# EAGLE design StormNet18-v0.1 (EAGLE 7.7.0)
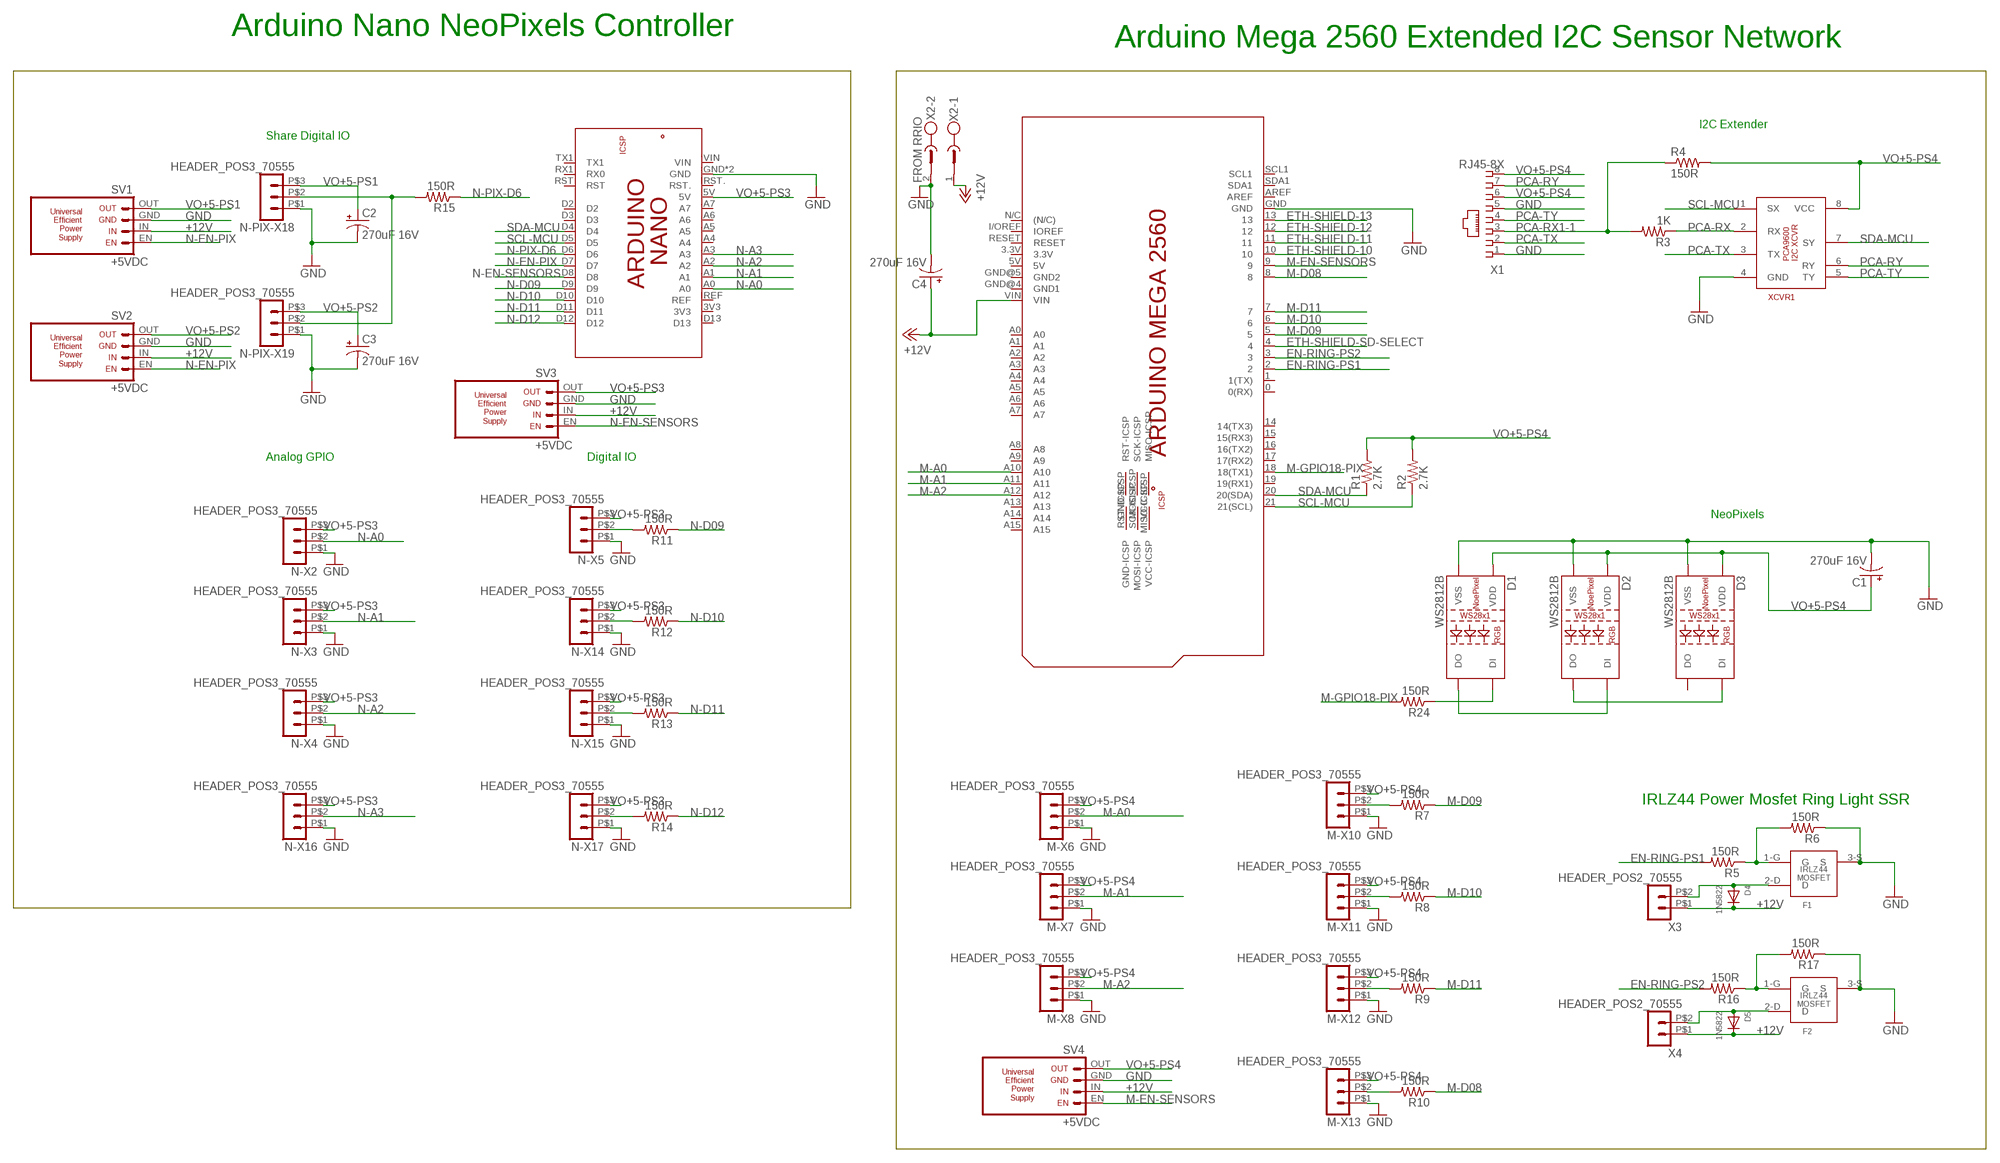
[diagram p0: schematic, sheet 1]

## Parts
C1  270uF 16V  CPOL-USE3.5-8  [E3,5-8]
C2  270uF 16V  CPOL-USE3.5-8  [E3,5-8]
C3  270uF 16V  CPOL-USE3.5-8  [E3,5-8]
C4  270uF 16V  CPOL-USE3.5-8  [E3,5-8]
D1  WS2812B  [WS2812B]
D2  WS2812B  [WS2812B]
D3  WS2812B  [WS2812B]
D4  1N5822  DIODESMA  [SMADIODE]
D5  1N5822  DIODESMA  [SMADIODE]
F1  IRLZ44  [IRLZ44-TO220]
F2  IRLZ44  [IRLZ44-TO220]
M-X6  HEADER_POS3_70555  [70555-POS3]
M-X7  HEADER_POS3_70555  [70555-POS3]
M-X8  HEADER_POS3_70555  [70555-POS3]
M-X10  HEADER_POS3_70555  [70555-POS3]
M-X11  HEADER_POS3_70555  [70555-POS3]
M-X12  HEADER_POS3_70555  [70555-POS3]
M-X13  HEADER_POS3_70555  [70555-POS3]
N-PIX-X18  HEADER_POS3_70555  [70555-POS3]
N-PIX-X19  HEADER_POS3_70555  [70555-POS3]
N-X2  HEADER_POS3_70555  [70555-POS3]
N-X3  HEADER_POS3_70555  [70555-POS3]
N-X4  HEADER_POS3_70555  [70555-POS3]
N-X5  HEADER_POS3_70555  [70555-POS3]
N-X14  HEADER_POS3_70555  [70555-POS3]
N-X15  HEADER_POS3_70555  [70555-POS3]
N-X16  HEADER_POS3_70555  [70555-POS3]
N-X17  HEADER_POS3_70555  [70555-POS3]
PCB2  ARDUINO_MEGA2560_SMALL  [ARDUINO_MEGA2560_SMALL]
PCB3  ARDUINO_NANOWITHOUT_ICSP  [ARDUINO_NANO]
R1  2.7K  R-US_R0603  [R0603]
R2  2.7K  R-US_R0603  [R0603]
R3  1K  R-US_R0603  [R0603]
R4  150R  R-US_R0603  [R0603]
R5  150R  R-US_R0603  [R0603]
R6  150R  R-US_R0603  [R0603]
R7  150R  R-US_R0603  [R0603]
R8  150R  R-US_R0603  [R0603]
R9  150R  R-US_R0603  [R0603]
R10  150R  R-US_R0603  [R0603]
R11  150R  R-US_R0603  [R0603]
R12  150R  R-US_R0603  [R0603]
R13  150R  R-US_R0603  [R0603]
R14  150R  R-US_R0603  [R0603]
R15  150R  R-US_R0603  [R0603]
R16  150R  R-US_R0603  [R0603]
R17  150R  R-US_R0603  [R0603]
R24  150R  R-US_R0603  [R0603]
SV1  +5VDC  SUPPLY-UNIV-EFFICIENT  [PS-UNIV-EFFICIENT-3A]
SV2  +5VDC  SUPPLY-UNIV-EFFICIENT  [PS-UNIV-EFFICIENT-3A]
SV3  +5VDC  SUPPLY-UNIV-EFFICIENT  [PS-UNIV-EFFICIENT-3A]
SV4  +5VDC  SUPPLY-UNIV-EFFICIENT  [PS-UNIV-EFFICIENT-3A]
X1  RJ45-8X  [RJ45-NO-SHIELD]
X2  FROM RRIO  MSTBV2  [MSTBV2-SMALL]
X3  HEADER_POS2_70555  [70555-POS2]
X4  HEADER_POS2_70555  [70555-POS2]
XCVR1  PCA9600DSO8  [SO08]

## Nets
+12V [12VandGND]: C4.+ D4.C D5.C PCB2.VIN SV1.IN SV2.IN SV3.IN SV4.IN X2.1 X3.P$1 X4.P$1
EN-RING-PS1: PCB2.2 R5.2
EN-RING-PS2: PCB2.3 R16.2
ETH-SHIELD-10: PCB2.10
ETH-SHIELD-11: PCB2.11
ETH-SHIELD-12: PCB2.12
ETH-SHIELD-13: PCB2.13
ETH-SHIELD-SD-SELECT: PCB2.4
GND [12VandGND]: C1.- C2.- C3.- C4.- D1.3(VSS) D2.3(VSS) D3.3(VSS) F1.3-S(S) F2.3-S(S) M-X6.P$1 M-X7.P$1 M-X8.P$1 M-X10.P$1 M-X11.P$1 M-X12.P$1 M-X13.P$1 N-PIX-X18.P$1 N-PIX-X19.P$1 N-X2.P$1 N-X3.P$1 N-X4.P$1 N-X5.P$1 N-X14.P$1 N-X15.P$1 N-X16.P$1 N-X17.P$1 PCB2.GND PCB3.GND PCB3.GND@1(GND) R6.1 R17.1 SV1.GND SV2.GND SV3.GND SV4.GND X1.1 X1.5 X2.2 XCVR1.4(GND)
M-A0: M-X6.P$2 PCB2.A10
M-A1: M-X7.P$2 PCB2.A11
M-A2: M-X8.P$2 PCB2.A12
M-D08: PCB2.8 R10.1
M-D09: PCB2.5 R7.1
M-D10: PCB2.6 R8.1
M-D11: PCB2.7 R9.1
M-EN-SENSORS: PCB2.9 SV4.EN
M-GPIO18-PIX: PCB2.18(18(TX1)) R24.2
N$1: M-X10.P$2 R7.2
N$2: N-PIX-X18.P$2 N-PIX-X19.P$2 R15.2
N$3: M-X11.P$2 R8.2
N$4: M-X12.P$2 R9.2
N$5: M-X13.P$2 R10.2
N$8: F1.1-G(G) R5.1 R6.2
N$9 [12VandGND]: D4.A F1.2-D(D) X3.P$2
N$10: N-X5.P$2 R11.2
N$11: N-X14.P$2 R12.2
N$12: N-X15.P$2 R13.2
N$13: N-X17.P$2 R14.2
N$14: F2.1-G(G) R16.1 R17.2
N$15 [12VandGND]: D5.A F2.2-D(D) X4.P$2
N$24: D1.4(DI) R24.1
N$25: D2.2(DO) D3.4(DI)
N$26: D1.2(DO) D2.4(DI)
N-A0: N-X2.P$2 PCB3.A0
N-A1: N-X3.P$2 PCB3.A1
N-A2: N-X4.P$2 PCB3.A2
N-A3: N-X16.P$2 PCB3.A3
N-D09: PCB3.D9 R11.1
N-D10: PCB3.D10 R12.1
N-D11: PCB3.D11 R13.1
N-D12: PCB3.D12 R14.1
N-EN-PIX: PCB3.D7 SV1.EN SV2.EN
N-EN-SENSORS: PCB3.D8 SV3.EN
N-PIX-D6: PCB3.D6 R15.1
PCA-RX: R3.1 XCVR1.2(RX)
PCA-RX1-1: R3.2 R4.1 X1.3
PCA-RY: X1.7 XCVR1.6(RY)
PCA-TX: X1.2 XCVR1.3(TX)
PCA-TY: X1.4 XCVR1.5(TY)
SCL-MCU: PCB2.21(21(SCL)) PCB3.D5 R2.1 XCVR1.1(SX)
SDA-MCU: PCB2.20(20(SDA)) PCB3.D4 R1.1 XCVR1.7(SY)
VO+5-PS1 [5v]: C2.+ N-PIX-X18.P$3 SV1.OUT
VO+5-PS2 [5v]: C3.+ N-PIX-X19.P$3 SV2.OUT
VO+5-PS3 [5v]: N-X2.P$3 N-X3.P$3 N-X4.P$3 N-X5.P$3 N-X14.P$3 N-X15.P$3 N-X16.P$3 N-X17.P$3 PCB3.5V SV3.OUT
VO+5-PS4 [5v]: C1.+ D1.1(VDD) D2.1(VDD) D3.1(VDD) M-X6.P$3 M-X7.P$3 M-X8.P$3 M-X10.P$3 M-X11.P$3 M-X12.P$3 M-X13.P$3 R1.2 R2.2 R4.2 SV4.OUT X1.6 X1.8 XCVR1.8(VCC)
Unconnected: D3.2(DO) PCB2.0(0(RX)) PCB2.1(1(TX)) PCB2.14(14(TX3)) PCB2.15(15(RX3)) PCB2.16(16(TX2)) PCB2.17(17(RX2)) PCB2.19(19(RX1)) PCB2.A0 PCB2.A1 PCB2.A2 PCB2.A3 PCB2.A4 PCB2.A5 PCB2.A6 PCB2.A7 PCB2.A8 PCB2.A9 PCB2.A13 PCB2.A14 PCB2.A15 PCB2.AREF PCB2.GND-ICSP PCB2.I/OREF(IOREF) PCB2.MISO-ICSP PCB2.MOSI-ICSP PCB2.N/C((N/C)) PCB2.RESET PCB2.RST-ICSP PCB2.SCK-ICSP PCB2.SCL1 PCB2.SDA1 PCB2.VCC-ICSP PCB3.3V3 PCB3.A4 PCB3.A5 PCB3.A6 PCB3.A7 PCB3.D2 PCB3.D3 PCB3.D13 PCB3.REF PCB3.RST PCB3.RST. PCB3.RX1(RX0) PCB3.TX1 PCB3.VIN

## Notes on the sheet
- Arduino Nano NeoPixels Controller
- Arduino Mega 2560 Extended I2C Sensor Network
- I2C Extender
- Share Digital IO
- Analog GPIO | Digital IO
- NeoPixels
- IRLZ44 Power Mosfet Ring Light SSR

## Power pins joined to a net without a drawn wire
3.3V: PCB2.3.3V
5V: PCB2.5V
GND1: PCB2.GND@4(GND1)
GND2: PCB2.GND@5(GND2)

## Library data of the parts
C1-C4 = rcl:CPOL-US: POLARIZED CAPACITOR, American symbol
D1-D3 = SparkFun-LED:WS2812B: WS2812B SMD addressable RGB LED 5x5mm SMD LED with built-in controller IC. Color: Red/Green/Blue mC Rating: RGB: 390, 660, 180 mcd Forward Voltage: RGB: 2.0, 3.0, 3.0 V Packages:WS2812B SparkFun Products: Blynk Board - ESP8266 <https://www.sparkfun.com/products/13794>; PROD_ID: DIO-12503
D4 D5 = adafruit:DIODE: Diode SMADIODE - SMA Surface Mount Package 20V 1A Schottky Diode Digikey: 641-1014-6-ND DO-1N4148 - Through Hole Small Current Diode SOD-123 20V 1 A (.5mV Vf) Schottky Diode - Digikey: MBRX120TPMSCT-ND SOD-323 10V 570mA (.38mV Vf, 3ns) Schottky Diode - Digikey: ZLLS410CT-ND SOD-523 30V 30mA Schottky Diode (RB751S-40TE61) - Digikey: RB751S-40TE61CT-ND SOT23-R/W - SOT23 Package (R = Solder Paste/Reflow Ovens, W = Hand-Soldering) BAT54Film 40V 300mA - Digikey: 497-7162-1-ND
F1 F2 = Stormgears-2018:IRLZ44
M-X6-M-X8 M-X10-M-X13 N-PIX-X18 N-PIX-X19 N-X2-N-X5 N-X14-N-X17 = con-molex-c-grid-sl:HEADER_POS3_?: Molex -C-Grid® / SL Series connector Wire-to-Board 2.54 mm (0.100") pitch header, 3 positions.
PCB2 = Arduino_Nano:ARDUINO_MEGA2560_SMALL: Device for representing an Arduino Mega 2560 board with a footprint in an EAGLE design. Created by Dave Young for Element14. More EAGLE documentation at: http://www.element14.com/community/community/knode/cadsoft_eagle
PCB3 = Arduino_Nano:ARDUINO_NANO: Device for representing an Arduino Nano board with a footprint in an EAGLE design. Created by Dave Young for Element14. More EAGLE documentation at: http://www.element14.com/community/community/knode/cadsoft_eagle
R1-R17 R24 = resistor:R-US_: RESISTOR, American symbol
SV1-SV4 = con-lstb:SUPPLY-UNIV-EFFICIENT: PIN HEADER; OC_FARNELL: unknown; OC_NEWARK: unknown
X1 = con-tycoelectronics:RJ45: CORCOM Modular RJ Jacks No Shield Source: www.tycoelectronics.com .. ENG_DS_1654001_1099_RJ_L_0507.pdf; MPN: RJ45-8X; OC_FARNELL: unknown; OC_NEWARK: 16R6101
X2 = con-phoenix-500:MSTBV2: PHOENIX
X3 X4 = con-molex-c-grid-sl:HEADER_POS2_?: Molex -C-Grid® / SL Series connector Wire-to-Board 2.54 mm (0.100") pitch header, 2 positions.
XCVR1 = adafruit:PCA9600D: NXP PCA9600 I2C long distance driver

## Net classes
1 12VandGND: width 1.524 mm
2 5v: width 0.635 mm

## Board
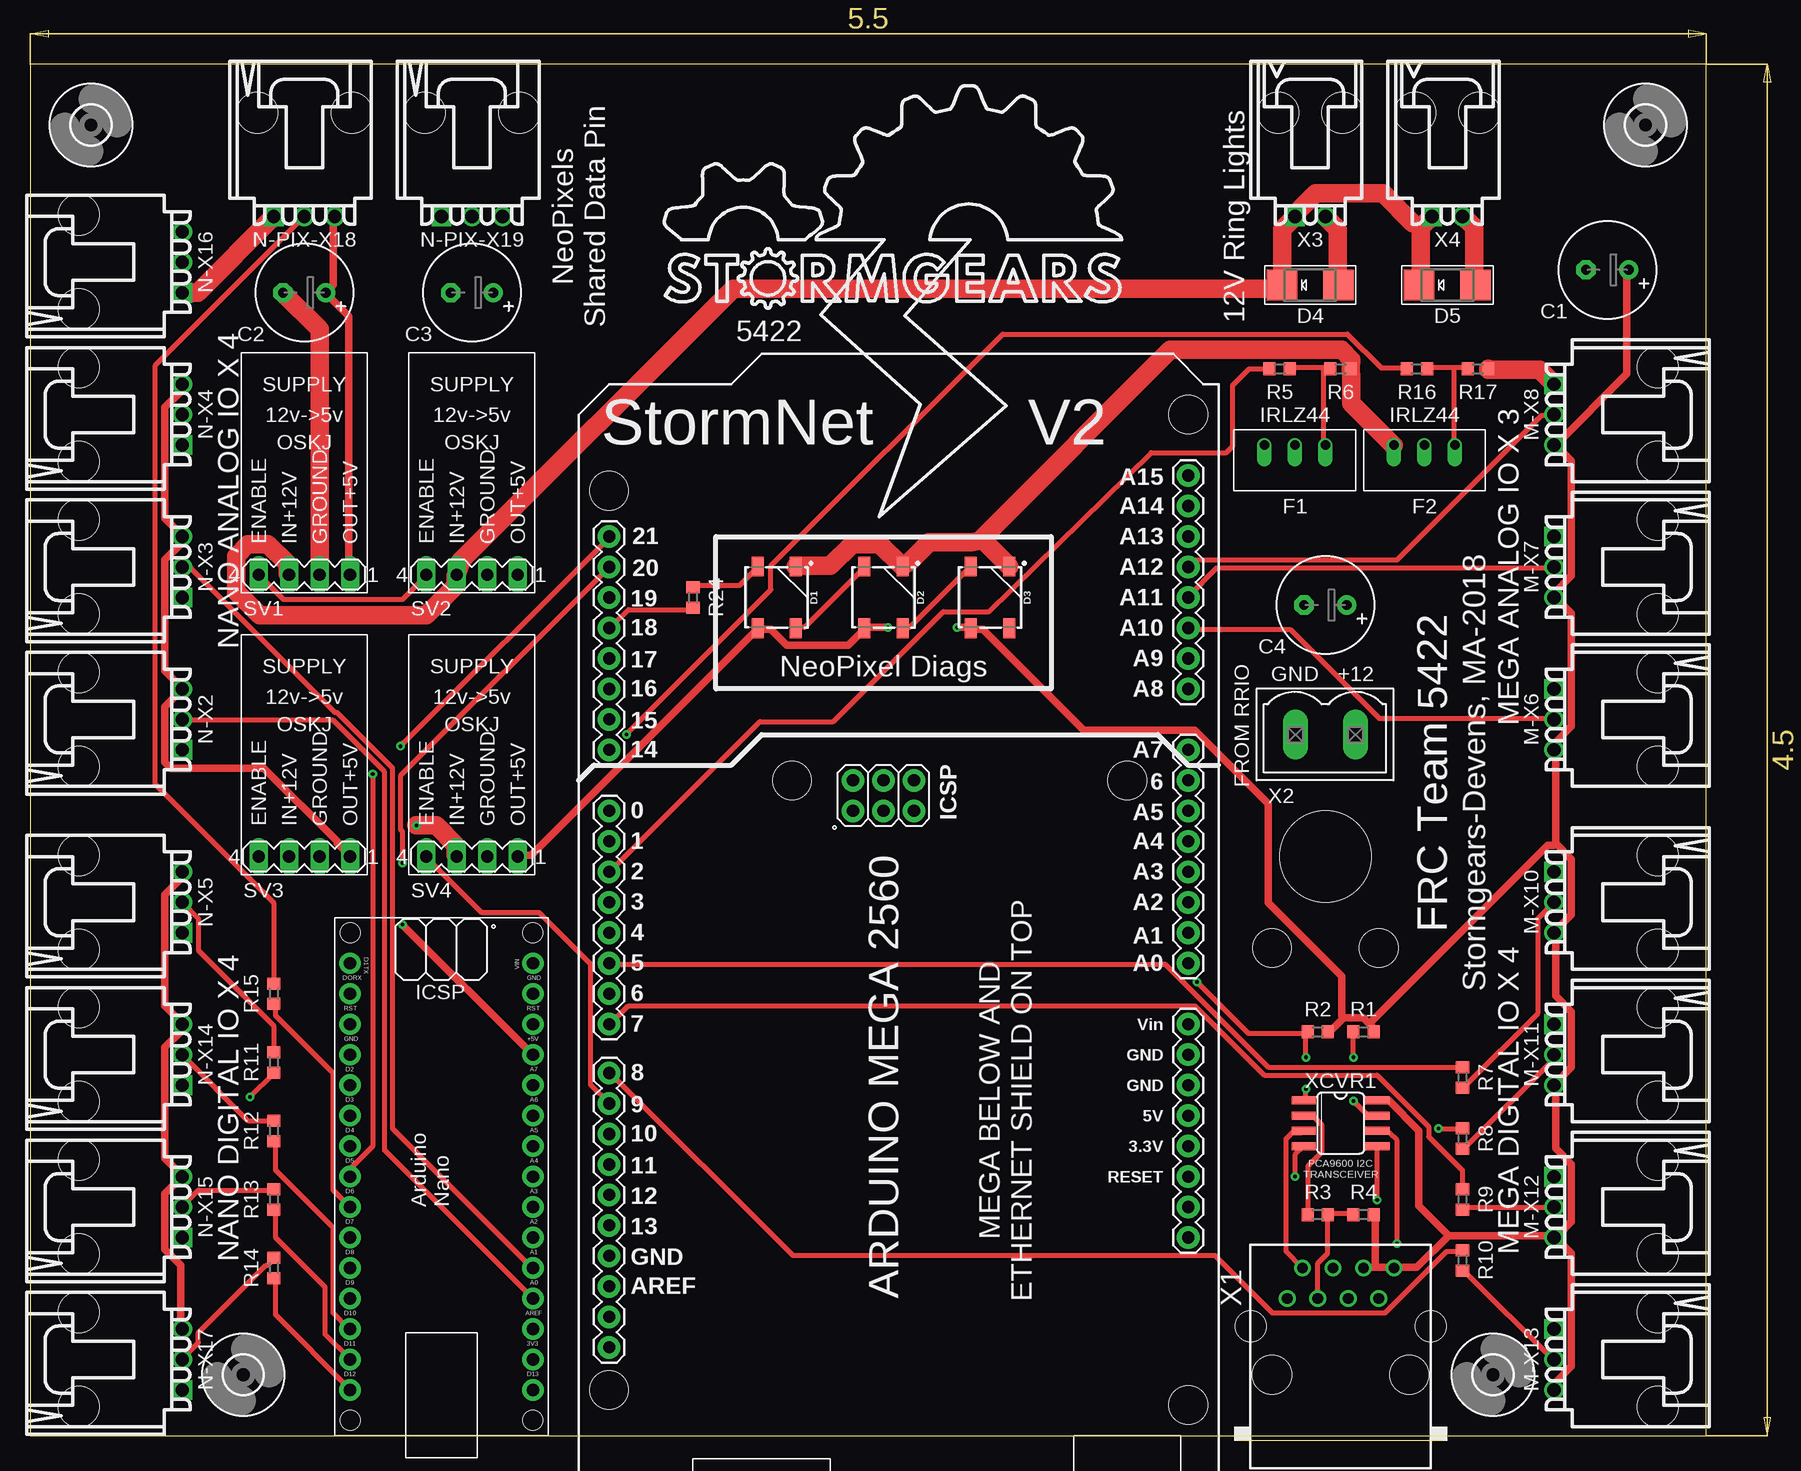
[diagram p1: board, top side]
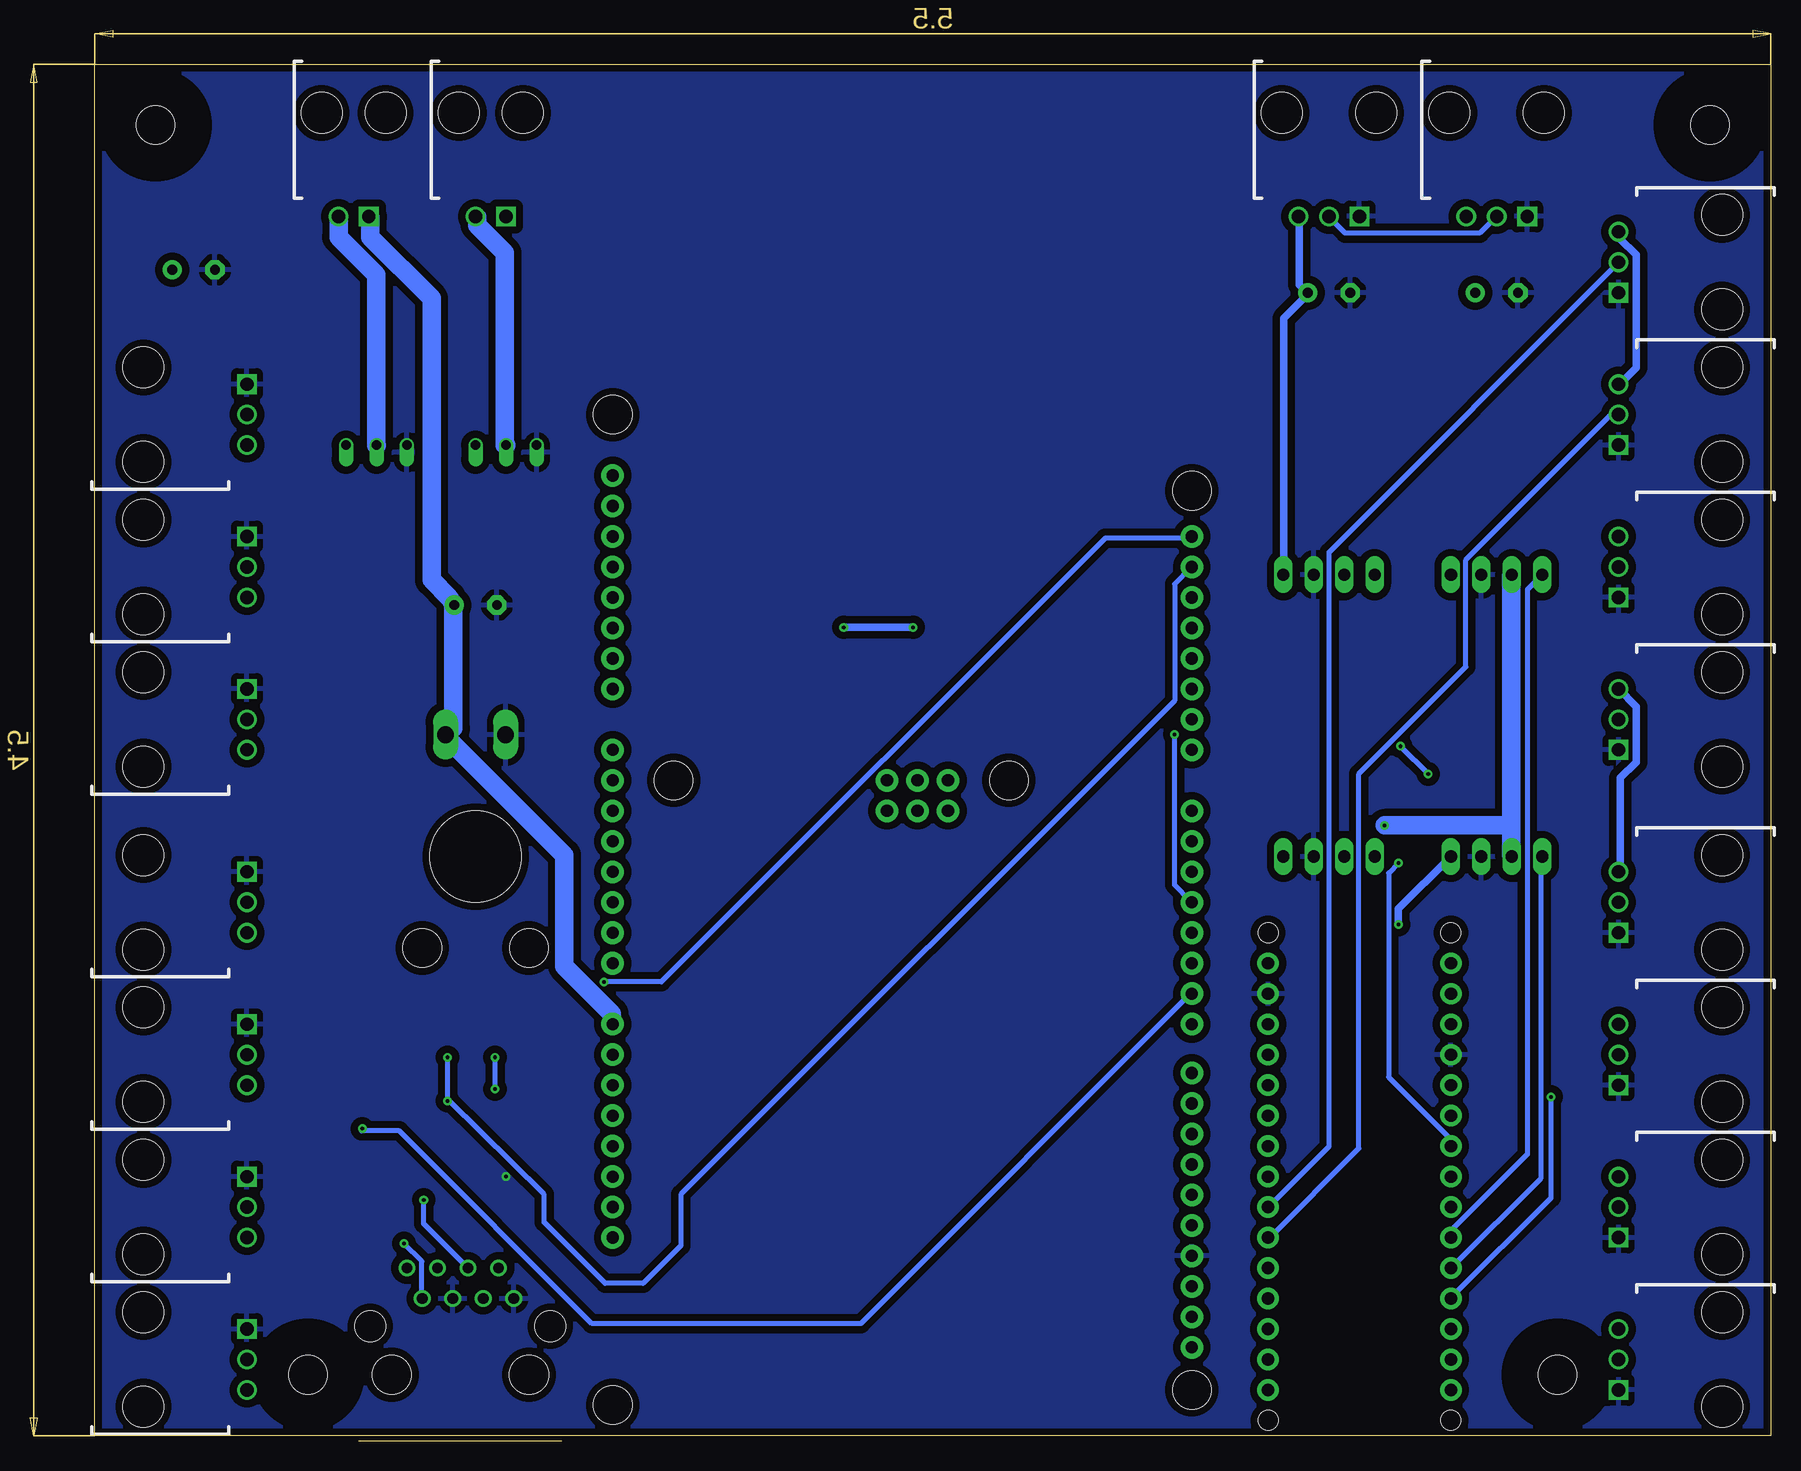
[diagram p2: board, bottom side, seen from below]

Size 139.7 x 114.3 mm. Coordinates in mm from the lower left corner, seen from the top.
Outline: 0,0 139.7,0 139.7,114.3 0,114.3 0,0
Copper layers (1*16): Top 0.035mm / dielectric 1.5mm / Bottom 0.035mm
Design rules "default *": minimum track width 16mil, minimum drill 12mil, track to track 10mil, track to pad 10mil, pad to pad 10mil, via to via 10mil, smd to smd 10mil, copper to edge 20mil, drill to drill 0.3mm, minimum pad ring 0mil, minimum via ring 8mil, stop-mask expansion 4mil, vias tented up to drill 0mil, thermal gap 20mil
Holes 3.2 mm at 103.5,40.64 112.39,40.64
Holes 7.62 mm at 107.95,48.26

### Footprints (pad centres in the part's own frame; a part is rotated, then mirrored left to right if it is on the bottom)
E3,5-8 = drill 0.813 pad 1.6: + -1.778,0 | drill 0.813 pad 1.6 octagon: - 1.778,0
WS2812B = smd 1.651 x 1: 1 2.577,-1.6; 2 2.577,1.6; 3 -2.577,1.6; 4 -2.577,-1.6
SMADIODE = smd 2.54 x 2.54: A 2.349,0; C -2.349,0
IRLZ44-TO220 = drill 0.8 offset: 1-G 0,0; 2-D 2.54,0; 3-S 5.08,0
70555-POS3 = drill 1.1 square: P$1 -2.54,0 | drill 1.1: P$2 0,0; P$3 2.54,0 | hole 3.404: -3.937,8.636; 3.937,8.636
ARDUINO_MEGA2560_SMALL = drill 1.016 pad 1.88: 0 63.5,50.8; 1 60.96,50.8; 2 58.42,50.8; 3 55.88,50.8; 3.3V 35.56,2.54; 4 53.34,50.8; 5 50.8,50.8; 5V 38.1,2.54; 6 48.26,50.8; 7 45.72,50.8; 8 41.656,50.8; 9 39.116,50.8; 10 36.576,50.8; 11 34.036,50.8; 12 31.496,50.8; 13 28.956,50.8; 14 68.58,50.8; 15 71.12,50.8; 16 73.66,50.8; 17 76.2,50.8; 18 78.74,50.8; 19 81.28,50.8; 20 83.82,50.8; 21 86.36,50.8; A0 50.8,2.54; A1 53.34,2.54; A2 55.88,2.54; A3 58.42,2.54; A4 60.96,2.54; A5 63.5,2.54; A6 66.04,2.54; A7 68.58,2.54; A8 73.66,2.54; A9 76.2,2.54; A10 78.74,2.54; A11 81.28,2.54; A12 83.82,2.54; A13 86.36,2.54; A14 88.9,2.54; A15 91.44,2.54; AREF 23.876,50.8; GND 26.416,50.8; GND-ICSP 66.04,25.4; GND@4 43.18,2.54; GND@5 40.64,2.54; I/OREF 30.48,2.54; MISO-ICSP 63.5,30.48; MOSI-ICSP 66.04,27.94; N/C 27.94,2.54; RESET 33.02,2.54; RST-ICSP 63.5,25.4; SCK-ICSP 63.5,27.94; SCL1 18.796,50.8; SDA1 21.336,50.8; VCC-ICSP 66.04,30.48; VIN 45.72,2.54 | hole 3.2: 15.24,50.8; 13.97,2.54; 66.04,35.56; 66.04,7.62; 90.17,50.8; 96.52,2.54
ARDUINO_NANO = drill 1.016 pad 1.778: 3V3 6.35,1.27; 5V 31.75,1.27; A0 11.43,1.27; A1 13.97,1.27; A2 16.51,1.27; A3 19.05,1.27; A4 21.59,1.27; A5 24.13,1.27; A6 26.67,1.27; A7 29.21,1.27; D2 29.21,16.51; D3 26.67,16.51; D4 24.13,16.51; D5 21.59,16.51; D6 19.05,16.51; D7 16.51,16.51; D8 13.97,16.51; D9 11.43,16.51; D10 8.89,16.51; D11 6.35,16.51; D12 3.81,16.51; D13 3.81,1.27; GND 36.83,1.27; GND@1 31.75,16.51; REF 8.89,1.27; RST 34.29,16.51; RST. 34.29,1.27; RX1 36.83,16.51; TX1 39.37,16.51; VIN 39.37,1.27 | hole 1.651: 1.27,1.27; 1.27,16.51; 41.91,16.51; 41.91,1.27
R0603 = smd 1 x 1.1: 1 -0.85,0; 2 0.85,0
PS-UNIV-EFFICIENT-3A = drill 1.016 long: EN 3.81,0; GND -1.27,0; IN 1.27,0; OUT -3.81,0
3,2 = hole 3.2: 0,0
RJ45-NO-SHIELD = drill 0.9 pad 1.4: 1 -4.445,6.35; 2 -3.175,8.89; 3 -1.905,6.35; 4 -0.635,8.89; 5 0.635,6.35; 6 1.905,8.89; 7 3.175,6.35; 8 4.445,8.89 | hole 3.251: -5.715,0; 5.715,0 | hole 2.55: 7.5,4.05; -7.5,4.05
MSTBV2-SMALL = drill 1.397 long: 1 -2.5,0; 2 2.5,0
70555-POS2 = drill 1.1 square: P$1 -1.27,0 | drill 1.1: P$2 1.27,0 | hole 3.404: -2.667,8.636; 2.667,8.636
SO08 = smd 0.66 x 2.032: 1 -1.905,-3.073; 2 -0.635,-3.073; 3 0.635,-3.073; 4 1.905,-3.073; 5 1.905,3.073; 6 0.635,3.073; 7 -0.635,3.073; 8 -1.905,3.073

### Placement (x,y rotation side)
C1  131.44,97.16 180 top
C2  22.86,95.25 180 top
C3  36.83,95.25 180 top
C4  107.95,69.22 180 top
D1  62.23,69.85 270 top
D2  71.12,69.85 270 top
D3  80.01,69.85 270 top
D4  106.68,95.89 0 top
D5  118.11,95.89 0 top
F1  107.95,82.55 180 top
F2  118.75,82.55 180 top
M-X6  127,59.69 270 top
M-X7  127,72.39 270 top
M-X8  127,85.09 270 top
M-X10  127,44.45 270 top
M-X11  127,31.75 270 top
M-X12  127,19.05 270 top
M-X13  127,6.35 270 top
N-PIX-X18  22.86,101.6 0 top
N-PIX-X19  36.83,101.6 0 top
N-X2  12.7,59.69 90 top
N-X3  12.7,72.39 90 top
N-X4  12.7,85.09 90 top
N-X5  12.7,44.45 90 top
N-X14  12.7,31.75 90 top
N-X15  12.7,19.05 90 top
N-X16  12.7,97.79 90 top
N-X17  12.7,6.35 90 top
PCB2  99.06,-11.43 90 top
PCB3  43.18,0 90 top
R1  111.12,33.66 0 top
R2  107.31,33.66 0 top
R3  107.31,18.41 0 top
R4  111.12,18.41 0 top
R5  104.14,88.9 180 top
R6  109.22,88.9 180 top
R7  119.38,29.84 270 top
R8  119.38,24.77 270 top
R9  119.38,19.68 270 top
R10  119.38,14.61 270 top
R11  20.32,31.11 90 top
R12  20.32,25.4 90 top
R13  20.32,19.68 90 top
R14  20.32,13.97 90 top
R15  20.32,36.83 90 top
R16  115.57,88.9 180 top
R17  120.65,88.9 180 top
R24  55.24,69.85 270 top
SV1  22.86,71.75 180 top
SV2  36.83,71.75 180 top
SV3  22.86,48.26 180 top
SV4  36.83,48.26 180 top
U$1  [3,2]  121.92,5.08 0 top
U$2  [3,2]  17.78,5.08 0 top
U$3  [3,2]  5.08,109.22 0 top
U$4  [3,2]  134.62,109.22 0 top
X1  109.22,5.08 0 top
X2  107.95,58.42 180 top
X3  106.68,101.6 0 top
X4  118.11,101.6 0 top
XCVR1  109.22,26.04 270 top

### Tracks (layer width: path | path; a pad name or v marks a point on that pad's centre or on a via)
+12V  (via drill 0.3)
  Top 1.524: v32.19,50.85 33.85,50.85 35.5,49.2 35.5,48.37 SV4.IN | SV1.IN 21.46,71.82 21.46,72.64 19.81,74.3 18.16,74.3 17.17,73.3 17.17,70.33 19.15,68.35 33.02,68.35 35.5,70.83 35.5,71.65 SV2.IN 35.83,72.48 35.83,72.81 58.61,95.59 103.68,95.59 D4.C 104.34,95.92 104.34,100.55 105.33,101.54 X3.P$1 105.83,102.2 107.15,103.52 112.76,103.52 115.24,101.04 115.9,100.71 | 115.9,100.71 115.9,95.92 D5.C | 115.9,100.71 116.73,101.54 X4.P$1
  Bottom 1.524: 21.63,50.85 21.63,71.65 SV1.IN | 21.63,50.85 21.63,48.37 SV3.IN | 21.63,50.85 v32.19,50.85 | PCB2.VIN 96.58,34.34 96.58,35.17 100.55,39.13 100.55,48.37 109.96,57.78 X2.1 110.29,58.45 109.79,58.94 109.79,69.18 C4.+ 110.12,69.84 111.61,71.32 111.61,94.77 116.73,99.89 116.73,101.54 X4.P$1
EN-RING-PS1
  Top 0.406: 103.19,88.82 R5.2 101.6,88.9 100.23,87.53 100.23,82.45 99.69,81.92 93.42,81.92 79.91,68.68 76.11,68.68 66.93,59.5 60.82,59.5 48.37,47.05 PCB2.2
EN-RING-PS2  (via drill 0.3)
  Top 0.406: v49.7,58.45 61.75,70.5 61.75,72.48 81.06,91.8 109.79,91.8 112.6,88.99 114.58,88.99 R16.2
  Bottom 0.406: v49.7,58.45 49.7,45.9 48.37,44.58 PCB2.3
GND  (via drill 0.3)
  Top 0.406: XCVR1.4 105.41,23.39 v105.41,21.59
  Top 1.524: M-X8.P$1 125.81,88.82 121.51,88.82 R17.1 | 79.3,74.74 95.03,90.47 109.3,90.47 110.12,89.65 R6.1 110.12,88.16 110.12,86.02 113.59,82.55 F2.3-S | 79.3,74.74 79.13,74.57 78.42,74.46 74.95,74.46 73.3,72.81 72.64,72.48 | SV1.GND 24.13,92.2 C2.- | N-X16.P$1 13.97,95.25 N-PIX-X18.P$1 | 79.3,74.74 81.56,72.48 D3.3 | 72.64,72.48 70.83,74.3 68.52,74.3 66.7,72.48 63.89,72.48 D1.3 | 72.64,72.48 D2.3
  pour Bottom (isolate 0.61): 0,0 0,114.3 139.7,114.3 139.7,0
M-A0
  Top 0.406: M-X6.P$2 126.96,59.77 112.43,59.77 105,67.2 96.58,67.2 PCB2.A10
M-A1
  Top 0.406: M-X7.P$2 126.96,72.31 98.89,72.31 96.58,70 PCB2.A11
M-A2
  Top 0.406: M-X8.P$2 126.96,85.03 125.97,85.03 113.92,72.97 97.08,72.97 96.58,72.48 PCB2.A12
M-D08
  Top 0.406: R10.1 119.37,15.35 118.05,15.35 112.93,10.24 103.52,10.24 98.73,15.02 63.56,15.02 48.37,30.21 PCB2.8
M-D09
  Top 0.406: R7.1 119.37,30.71 103.19,30.71 94.6,39.29 48.37,39.29 PCB2.5
M-D10  (via drill 0.3)
  Top 0.406: v117.39,25.59 119.37,25.59 R8.1
  Bottom 0.406: PCB2.6 48.37,36.82 75.84,9.35 98.25,9.35 114.3,25.4 117.47,25.4 v117.39,25.59
M-D11
  Top 0.406: R9.1 119.37,20.64 119.37,22.12 116.56,24.93 116.56,25.76 112.27,30.05 102.86,30.05 97.08,35.83 49.86,35.83 48.37,34.34 PCB2.7
M-EN-SENSORS
  Top 0.406: PCB2.9 46.72,29.22 46.72,39.29 42.43,43.59 37.64,43.59 33.02,48.21 SV4.EN
M-GPIO18-PIX
  Top 0.406: R24.2 55.14,68.85 49.86,68.85 48.37,67.36 PCB2.18
N$1
  Top 0.406: M-X10.P$2 125.64,43.09 125.64,35.17 119.53,29.06 R7.2
N$2
  Top 0.406: R15.2 20.31,37.81 20.31,44.41 10.4,54.32 10.4,89.15 22.78,101.54 N-PIX-X18.P$2
  Bottom 0.406: N-PIX-X19.P$2 36.82,101.54 35.5,100.22 24.27,100.22 22.95,101.54 N-PIX-X18.P$2
N$3
  Top 0.406: R8.2 119.53,23.94 126.96,31.37 126.96,31.7 M-X11.P$2
N$4
  Top 0.406: R9.2 119.53,18.99 126.96,18.99 M-X12.P$2
N$5
  Top 0.406: R10.2 119.53,13.7 126.96,6.27 M-X13.P$2
N$8
  Top 0.406: 107.81,88.99 108.31,88.99 R6.2 | 107.81,88.99 105,88.99 R5.1 | 107.81,88.99 107.81,82.55 F1.1-G
N$9
  Top 1.524: D4.A 108.97,95.92 108.97,100.55 107.97,101.54 X3.P$2
  Bottom 1.524: F1.2-D 105.5,82.55 105.5,98.56 107.81,100.88 107.81,101.54 X3.P$2
N$10
  Top 0.406: R11.2 20.31,32.03 20.31,34.18 14.03,40.45 14.03,43.09 12.71,44.41 N-X5.P$2
N$11
  Top 0.406: R12.2 20.31,26.25 18.16,26.25 12.71,31.7 N-X14.P$2
N$12
  Top 0.406: R13.2 20.31,20.47 14.03,20.47 12.71,19.15 N-X15.P$2
N$13
  Top 0.406: R14.2 20.31,14.69 19.81,14.2 19.65,14.2 14.03,8.59 14.03,7.76 12.71,6.44 N-X17.P$2
N$14
  Top 0.406: 118.71,88.99 119.7,88.99 R17.2 | 118.71,88.99 116.56,88.99 R16.1 | 118.71,88.99 118.71,82.55 F2.1-G
N$15
  Top 1.524: D5.A 120.36,95.92 120.36,100.71 119.53,101.54 X4.P$2
  Bottom 1.524: F2.2-D 116.23,82.55 116.23,96.75 119.37,99.89 119.37,101.54 X4.P$2
N$24
  Top 0.406: R24.1 55.31,70.83 59.11,70.83 60.59,72.31 D1.4
N$25
  Top 0.406: D2.2 72.81,67.36 73.3,67.36 78.26,72.31 D3.4
N$26
  Top 0.406: D1.2 63.89,67.36 64.55,67.36 69.51,72.31 D2.4
N-A0
  Top 0.406: N-X2.P$2 12.71,59.6 25.26,59.6 29.55,55.31 29.55,23.77 41.77,11.56 PCB3.A0
N-A1
  Top 0.406: N-X3.P$2 12.71,72.31 13.37,72.31 25.43,60.26 25.59,60.26 30.21,55.64 30.21,25.59 41.77,14.03 PCB3.A1
N-A2
  Bottom 0.406: N-X4.P$2 12.71,85.03 13.37,85.03 25.43,72.97 25.43,64.06 34.34,55.14 34.34,23.94 41.77,16.51 PCB3.A2
N-A3
  Bottom 0.406: N-X16.P$2 12.71,97.74 36.82,73.64 36.82,24.11 41.77,19.15 PCB3.A3
N-D09  (via drill 0.3)
  Top 0.406: v18.33,28.23 20.31,30.21 R11.1
  Bottom 0.406: v18.33,28.23 18.33,19.81 26.58,11.56 PCB3.D9
N-D10
  Top 0.406: R12.1 20.47,24.43 20.47,22.12 25.26,17.34 25.26,10.24 26.58,8.91 PCB3.D10
N-D11
  Top 0.406: PCB3.D11 24.6,8.42 24.6,12.38 20.47,16.51 20.47,18.82 R13.1
N-D12
  Top 0.406: R14.1 20.47,13.04 20.47,10.07 26.58,3.96 PCB3.D12
N-EN-PIX
  Top 0.406: SV1.EN 21.13,69.67 31.04,69.67 33.02,71.65 SV2.EN
  Bottom 0.406: SV1.EN 20.31,70.5 20.31,23.44 26.58,17.17 26.58,16.51 PCB3.D7
N-EN-SENSORS
  Bottom 0.406: SV3.EN 19.15,48.21 19.15,21.46 26.58,14.03 PCB3.D8
N-PIX-D6
  Top 0.406: R15.1 20.47,35.83 20.47,35 25.26,30.21 25.26,20.47 26.58,19.15 PCB3.D6
PCA-RX
  Top 0.406: R3.1 106.49,18.49 106.49,22.45 107.64,23.61 107.64,25.92 106.98,26.58 106.16,26.58 XCVR1.2
PCA-RX1-1
  Top 0.406: R4.1 110.12,18.49 108.31,18.49 R3.2 108.14,18.33 108.14,15.19 107.31,14.36 X1.3
PCA-RY  (via drill 0.3)
  Top 0.406: v113.92,16.02 113.92,24.6 113.26,25.26 112.43,25.26 XCVR1.6
  Bottom 0.406: v113.92,16.02 112.43,14.53 112.43,11.56 X1.7
PCA-TX
  Top 0.406: XCVR1.3 105.99,25.26 105.17,25.26 104.67,24.77 104.67,15.35 105.99,14.03 X1.2
PCA-TY  (via drill 0.3)
  Top 0.406: v112.27,19.65 112.27,24.11 XCVR1.5
  Bottom 0.406: v112.27,19.65 112.27,17.67 108.64,14.03 X1.4
SCL-MCU  (via drill 0.3)
  Top 0.406: v106.32,31.53 106.32,33.52 R2.1 106.16,33.52 101.54,33.52 v97.24,37.81 | v106.32,28.89 106.32,28.23 106.16,28.07 XCVR1.1 | v28.56,55.14 28.56,24.11 26.75,22.29 26.75,21.63 PCB3.D5 | v30.87,57.45 48.21,74.79 PCB2.21
  Bottom 0.406: v106.32,28.89 v106.32,31.53 | v30.87,57.45 v28.56,55.14 | v97.24,37.81 92.46,37.81 55.47,74.79 48.37,74.79 PCB2.21
SDA-MCU  (via drill 0.3)
  Top 0.406: v110.29,31.53 110.29,33.52 R1.1 | v110.29,27.9 111.44,26.75 112.27,26.75 XCVR1.7 | v31.04,47.71 31.04,50.35 30.87,50.52 30.87,54.98 48.21,72.31 PCB2.20
  Bottom 0.406: v110.29,31.53 v110.29,27.9 110.12,27.9 102.23,20.1 102.23,17.78 97.16,12.7 93.98,12.7 90.84,15.84 90.84,20.1 49.7,61.25 49.7,70.99 48.37,72.31 PCB2.20 | v31.04,47.71 31.86,46.89 31.86,29.88 26.75,24.77 26.75,24.27 PCB3.D4
VO+5-PS1
  Top 0.635: SV1.OUT 26.58,71.82 26.58,93.28 24.77,95.1 C2.+ 24.77,95.43 25.26,95.92 25.26,101.54 N-PIX-X18.P$3
VO+5-PS2
  Bottom 0.635: SV2.OUT 40.62,71.82 40.62,93.12 38.63,95.1 C3.+ 38.8,95.43 39.29,95.92 39.29,101.54 N-PIX-X19.P$3
VO+5-PS3  (via drill 0.3)
  Top 0.635: N-X17.P$3 12.55,8.91 12.55,14.2 11.23,15.52 11.23,20.14 12.55,21.46 N-X15.P$3 12.55,21.79 11.23,23.11 11.23,32.36 12.55,33.68 12.55,34.18 N-X14.P$3 12.55,34.51 11.23,35.83 11.23,45.07 12.55,46.39 12.55,46.89 N-X5.P$3 | SV3.OUT 26.58,48.37 25.59,49.37 25.59,49.53 19.48,55.64 11.72,55.64 11.23,56.13 11.23,60.76 N-X2.P$3 12.55,62.41 11.23,63.73 11.23,72.97 12.55,74.3 12.55,74.79 N-X3.P$3 12.55,75.12 11.23,76.44 11.23,85.69 12.55,87.01 12.55,87.5 N-X4.P$3 | v31.04,42.6 41.77,31.86 PCB3.5V
  Bottom 0.635: N-X16.P$3 12.55,100.22 12.55,99.72 11.23,98.4 11.23,88.99 12.55,87.67 N-X4.P$3 | v31.04,42.6 31.04,43.92 26.75,48.21 SV3.OUT | N-X2.P$3 11.23,60.76 11.23,56.13 12.55,54.81 12.55,47.05 N-X5.P$3
VO+5-PS4  (via drill 0.3)
  Top 0.635: SV4.OUT 40.78,48.37 41.77,48.37 60.43,67.03 D1.1 60.76,67.2 61.75,67.2 63.07,65.88 68.19,65.88 69.51,67.2 D2.1 69.84,67.36 v71.49,67.36 | 109.46,34.84 108.31,33.68 R2.2 | 109.46,34.84 111.11,34.84 111.61,34.34 | 111.61,34.34 111.94,34.01 111.94,33.68 R1.2 | 109.46,34.84 109.3,35 109.3,38.3 103.19,44.41 103.19,52.67 97.08,58.78 87.83,58.78 79.41,67.2 78.42,67.2 D3.1 78.09,67.36 v77.27,67.36 | C1.+ 133.07,97.08 133.07,88.49 127.13,82.55 M-X8.P$3 127.29,82.39 128.45,81.23 128.45,71.65 126.96,70.17 M-X7.P$3 127.13,69.84 128.45,68.52 128.45,59.11 127.13,57.78 127.13,57.29 M-X6.P$3 127.13,56.96 127.13,49.37 | 112.1,14.03 113.59,14.03 X1.8 113.92,14.03 115.57,14.03 118.21,16.68 | 112.1,14.03 111.28,14.03 X1.6 | M-X13.P$3 127.13,3.96 127.13,4.46 128.45,5.78 128.45,15.19 127.13,16.51 M-X12.P$3 | M-X12.P$3 127.29,16.68 128.45,17.83 128.45,22.62 127.13,23.94 127.13,29.06 M-X11.P$3 127.13,29.39 128.45,30.71 128.45,35.33 127.13,36.65 127.13,41.77 M-X10.P$3 127.13,42.1 128.45,43.42 128.45,48.04 127.13,49.37 | 118.21,16.68 126.8,16.68 M-X12.P$3 | 118.21,16.68 115.73,19.15 115.73,25.43 113.26,27.9 112.6,27.9 XCVR1.8 | 111.61,34.34 126.47,49.2 126.96,49.2 127.13,49.37 | 112.1,14.03 112.1,18.33 R4.2
  Bottom 0.635: v77.27,67.36 v71.49,67.36

### Text on the board
tPlace: StormNet | V2 | NeoPixel Diags | FRC Team 5422 | Stormgears-Devens, MA-2018
tNames: NeoPixels / Shared Data Pin | 12V Ring Lights | 5422 | NANO ANALOG IO X 4 | MEGA ANALOG IO X 3 | MEGA BELOW AND / ETHERNET SHIELD ON TOP | MEGA DIGITAL IO X 4 | NANO DIGITAL IO X 4